# EAGLE design rf212Doughter (EAGLE 4.16)
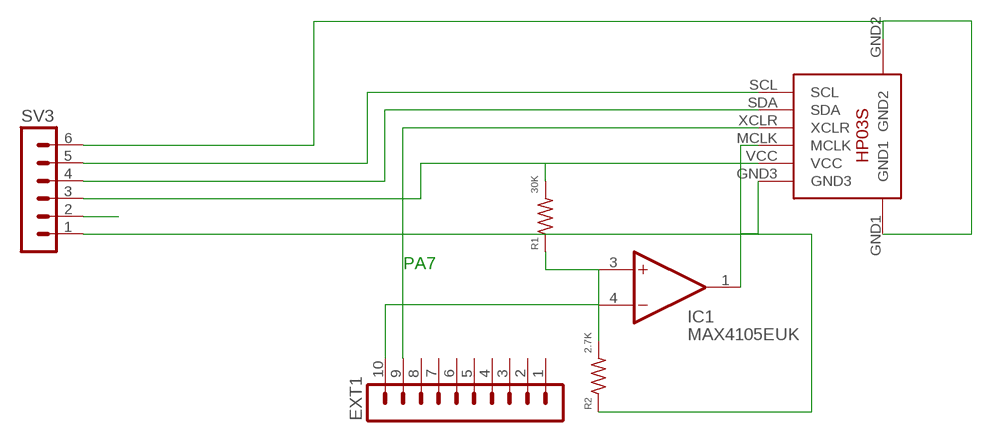
[diagram p0: schematic, sheet 1]

## Parts
EXT1  MA10-1  [MA10-1]
IC1  MAX4105EUK  [SOT23-5L]
R1  30K  R-US_R0603  [R0603]
R2  2.7K  R-US_R0603  [R0603]
SV3  MA06-1  [MA06-1]
U$1  HP03S  [HP03S]

## Nets
N$2: IC1.1(OUT) U$1.MCLK
N$3: EXT1.10 IC1.4(-IN)
N$4: IC1.3(+IN) R1.1 R2.2
PD4: EXT1.9 U$1.XCLR
SCL: SV3.5 U$1.SCL
SDA: SV3.4 U$1.SDA
V-IN: SV3.2
VCC: R1.2 SV3.3 U$1.VCC
VEE: R2.1 SV3.1 SV3.6 U$1.GND1 U$1.GND2 U$1.GND3
Unconnected: EXT1.1 EXT1.2 EXT1.3 EXT1.4 EXT1.5 EXT1.6 EXT1.7 EXT1.8

## Notes on the sheet
- PA7

## Power pins joined to a net without a drawn wire
VCC: IC1.5(VCC)
VEE: IC1.2(VEE)

## Library data of the parts
EXT1 = con-lstb:MA10-1: PIN HEADER
IC1 = maxim:MAX4105EUK: OP AMP
R1 R2 = rcl:R-US_: RESISTOR, American symbol
SV3 = con-lstb:MA06-1: PIN HEADER
U$1 = ATMEL:HP03S

## Board
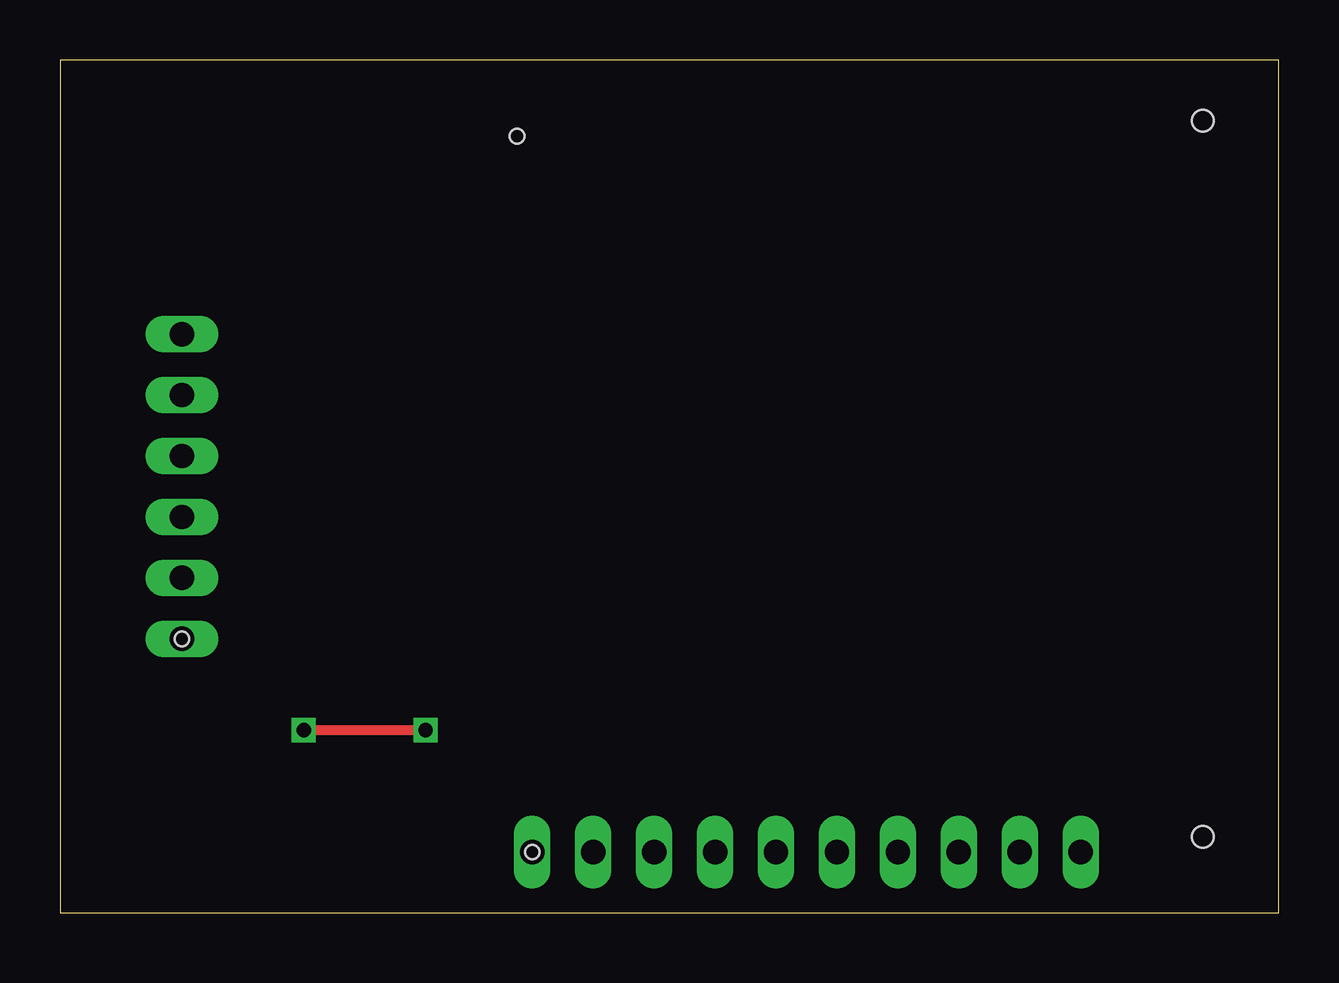
[diagram p1: board, top side]
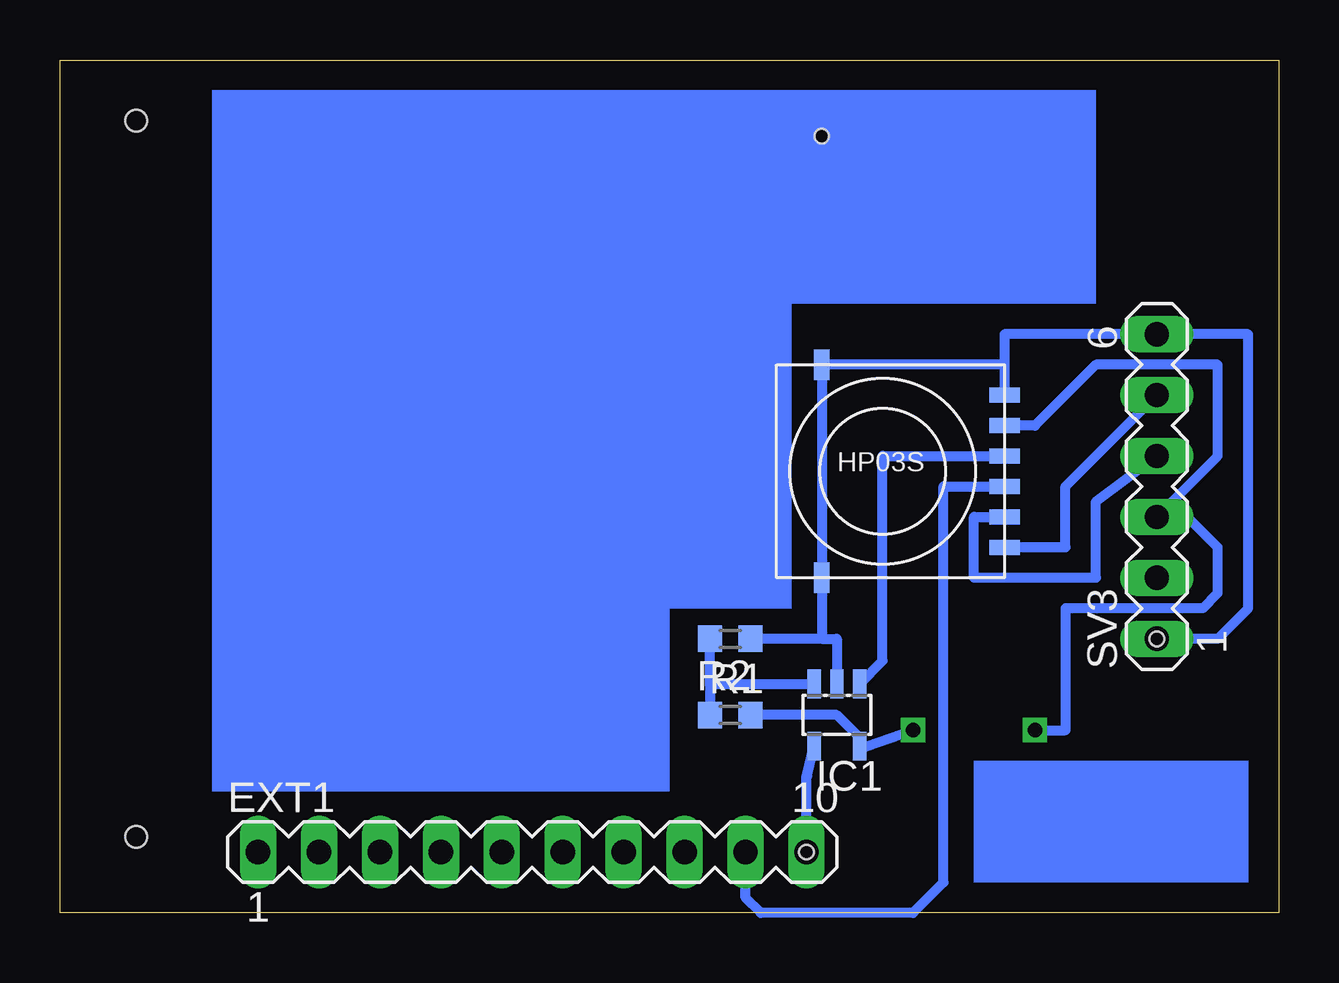
[diagram p2: board, bottom side, seen from below]

Size 50.8 x 35.56 mm. Coordinates in mm from the lower left corner, seen from the top.
Copper layers (1*2+15*16): Top 0.035mm / dielectric 0.2mm / Route2 0.035mm / dielectric 0.15mm / Route15 0.035mm / dielectric 0.2mm / Bottom 0.035mm
Design rules "default": minimum track width 10mil, minimum drill 24mil, track to track 8mil, track to pad 8mil, pad to pad 8mil, via to via 8mil, smd to smd 8mil, copper to edge 40mil, drill to drill 8mil, minimum pad ring 10mil, minimum via ring 8mil, stop-mask expansion 4mil, vias tented up to drill 0mil, thermal gap 10mil

### Footprints (pad centres in the part's own frame; a part is rotated, then mirrored left to right if it is on the bottom)
MA10-1 = drill 1.016 long: 1 -11.43,0; 2 -8.89,0; 3 -6.35,0; 4 -3.81,0; 5 -1.27,0; 6 1.27,0; 7 3.81,0; 8 6.35,0; 9 8.89,0; 10 11.43,0
SOT23-5L = smd 0.55 x 1.2: 1 -0.95,-1.3; 2 0,-1.3; 3 0.95,-1.3; 4 0.95,1.3; 5 -0.95,1.3
R0603 = smd 1 x 1.1: 1 -0.85,0; 2 0.85,0
MA06-1 = drill 1.016 long: 1 -6.35,0; 2 -3.81,0; 3 -1.27,0; 4 1.27,0; 5 3.81,0; 6 6.35,0
HP03S = smd 0.635 x 1.27: GND1 -7.62,7.62; GND2 -7.62,-1.27 | smd 1.27 x 0.635: GND3 0,6.35; MCLK 0,3.81; SCL 0,0; SDA 0,1.27; VCC 0,5.08; XCLR 0,2.54
RF_DOUGHTER = hole 0.6: 5.08,11.43; 19.685,2.54; 19.05,32.385 | hole 0.9: 47.625,33.02; 47.625,3.175

### Placement (x,y rotation side)
EXT1  31.11,2.54 0 bottom
IC1  18.41,8.26 180 bottom
R1  22.86,8.26 0 bottom
R2  22.86,11.43 180 bottom
SV3  5.08,17.78 90 bottom
U$1  11.43,15.24 0 bottom
U$2  [RF_DOUGHTER]  0,0 0 top

### Tracks (layer width: path | path; a pad name or v marks a point on that pad's centre or on a via)
N$2
  Bottom 0.406: IC1.1 16.51,10.51 16.51,19.05 U$1.MCLK
N$3
  Bottom 0.406: IC1.4 19.66,5.71 19.68,5.71 EXT1.10
N$4
  Bottom 0.406: 23.71,9.53 R1.1 | 23.71,9.53 R2.2 | IC1.3 19.39,9.53 23.71,9.53
PD4
  Bottom 0.406: EXT1.9 22.23,0.64 21.59,0 15.24,0 13.97,1.27 13.97,17.78 U$1.XCLR
SCL
  Bottom 0.406: SV3.5 8.89,17.78 8.89,15.24 U$1.SCL
SDA
  Bottom 0.406: SV3.4 7.62,17.14 7.62,13.97 12.7,13.97 12.7,16.51 U$1.SDA
VCC  (via drill 0.6)
  Top 0.406: v15.24,7.62 v10.16,7.62
  Bottom 0.406: 22.23,8.26 R1.2 18.41,8.26 17.46,7.3 IC1.5 17.18,6.96 v15.24,7.62 | U$1.VCC 10.16,20.32 7.62,22.86 2.54,22.86 2.54,19.05 SV3.3 3.81,16.51 2.54,15.24 2.54,13.34 3.18,12.7 8.89,12.7 8.89,7.62 v10.16,7.62
VEE
  Bottom 0.406: 11.43,22.86 U$1.GND3 | 11.43,22.86 U$1.GND1 U$1.GND2 19.05,11.43 | 19.05,11.43 R2.1 | IC1.2 18.41,11.43 19.05,11.43 | 11.43,22.86 11.43,24.13 SV3.6 1.27,24.13 1.27,12.7 2.54,11.43 SV3.1
(copper drawn outside any net)
  shapes: Bottom area x4